# EAGLE schematic LT6656_BREAKOUT (EAGLE 7.2.0)
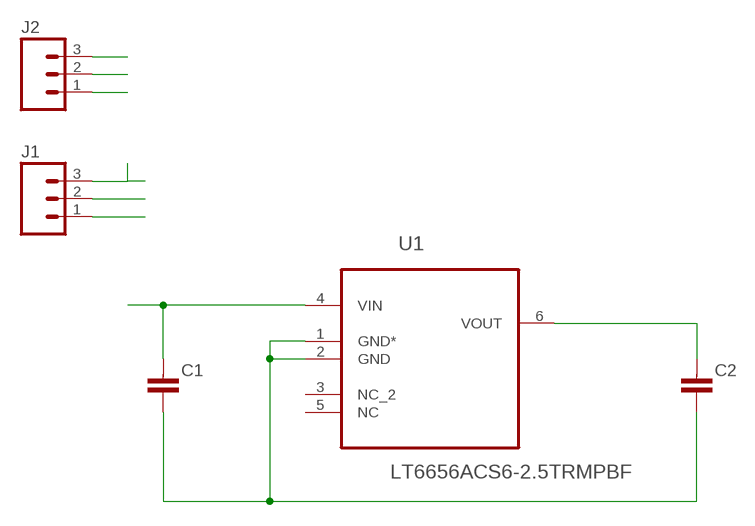
[diagram p0: schematic, sheet 1]

## Parts
C1  CAPACITOR0603-N  [C0603-N]
C2  CAPACITOR0603-N  [C0603-N]
J1  M03PTH  [1X03]
J2  M03PTH  [1X03]
U1  LT6656ACS6-2.5TRMPBF  [SOT95P280X100-6N]

## Nets
GND: C1.2 C2.2 J1.1 J2.1 U1.1(GND*) U1.2(GND)
OUT: J1.2 J2.2
VIN: C1.1 J1.3 U1.4(VIN)
VOUT: C2.1 J2.3 U1.6(VOUT)
Unconnected: U1.3(NC_2) U1.5(NC)

## Library data of the parts
C1 C2 = passives-7351:CAPACITOR
J1 J2 = SparkFun-Connectors:M03: Header 3 Standard 3-pin 0.1" header. Use with straight break away headers (SKU : PRT-00116), right angle break away headers (PRT-00553), swiss pins (PRT-00743), machine pins (PRT-00117), and female headers (PRT-00115). Molex polarized connector foot print use with SKU : PRT-08232 with associated crimp pins and housings.
U1 = LTC_By_element14_Batch_1:LT6656ACS6-2.5TRMPBF: 1uA Precision SeriesVoltage Reference; MPN: LT6656ACS6-2.5#TRMPBF; OC_FARNELL: -; OC_NEWARK: 72R5841; PACKAGE: TSOT-6; SUPPLIER: Linear Technology